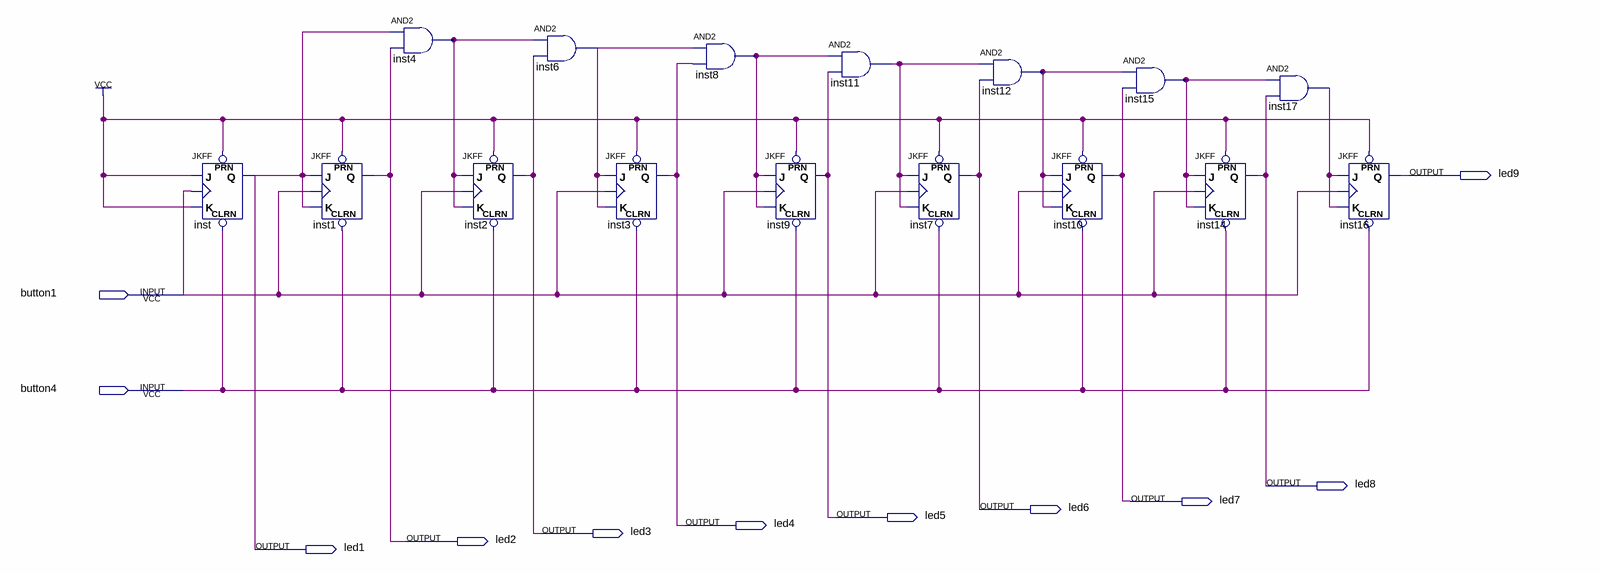
[diagram p0: schematic sheet]
// Quartus schematic Counter_9bit.bdf as structural Verilog: 16 symbols, 11 pins
module Counter_9bit (
  input  button1,
  input  button4,
  output led9,
  output led8,
  output led7,
  output led6,
  output led5,
  output led4,
  output led3,
  output led2,
  output led1
);

  wire inst4_out, inst6_out, inst8_out, inst11_out, inst12_out, inst15_out, inst17_out;

  JKFF inst (.PRN(1'b1), .CLRN(button4), .K(1'b1), .J(1'b1), .CLK(button1), .Q(led1));
  JKFF inst1 (.PRN(1'b1), .CLRN(button4), .K(led1), .J(led1), .CLK(button1), .Q(led2));
  and inst4 (inst4_out, led1, led2);
  JKFF inst2 (.PRN(1'b1), .CLRN(button4), .K(inst4_out), .J(inst4_out), .CLK(button1), .Q(led3));
  and inst6 (inst6_out, inst4_out, led3);
  JKFF inst3 (.PRN(1'b1), .CLRN(button4), .K(inst6_out), .J(inst6_out), .CLK(button1), .Q(led4));
  and inst8 (inst8_out, inst6_out, led4);
  JKFF inst9 (.PRN(1'b1), .CLRN(button4), .K(inst8_out), .J(inst8_out), .CLK(button1), .Q(led5));
  and inst11 (inst11_out, inst8_out, led5);
  JKFF inst7 (.PRN(1'b1), .CLRN(button4), .K(inst11_out), .J(inst11_out), .CLK(button1), .Q(led6));
  and inst12 (inst12_out, inst11_out, led6);
  JKFF inst10 (.PRN(1'b1), .CLRN(button4), .K(inst12_out), .J(inst12_out), .CLK(button1), .Q(led7));
  and inst15 (inst15_out, inst12_out, led7);
  JKFF inst14 (.PRN(1'b1), .CLRN(button4), .K(inst15_out), .J(inst15_out), .CLK(button1), .Q(led8));
  and inst17 (inst17_out, inst15_out, led8);
  JKFF inst16 (.PRN(1'b1), .CLRN(button4), .K(inst17_out), .J(inst17_out), .CLK(button1), .Q(led9));
endmodule
